# Altium schematic sheet reservoir_level_color.SchDoc
size A; SheetNumber: 1; SheetTotal: 1
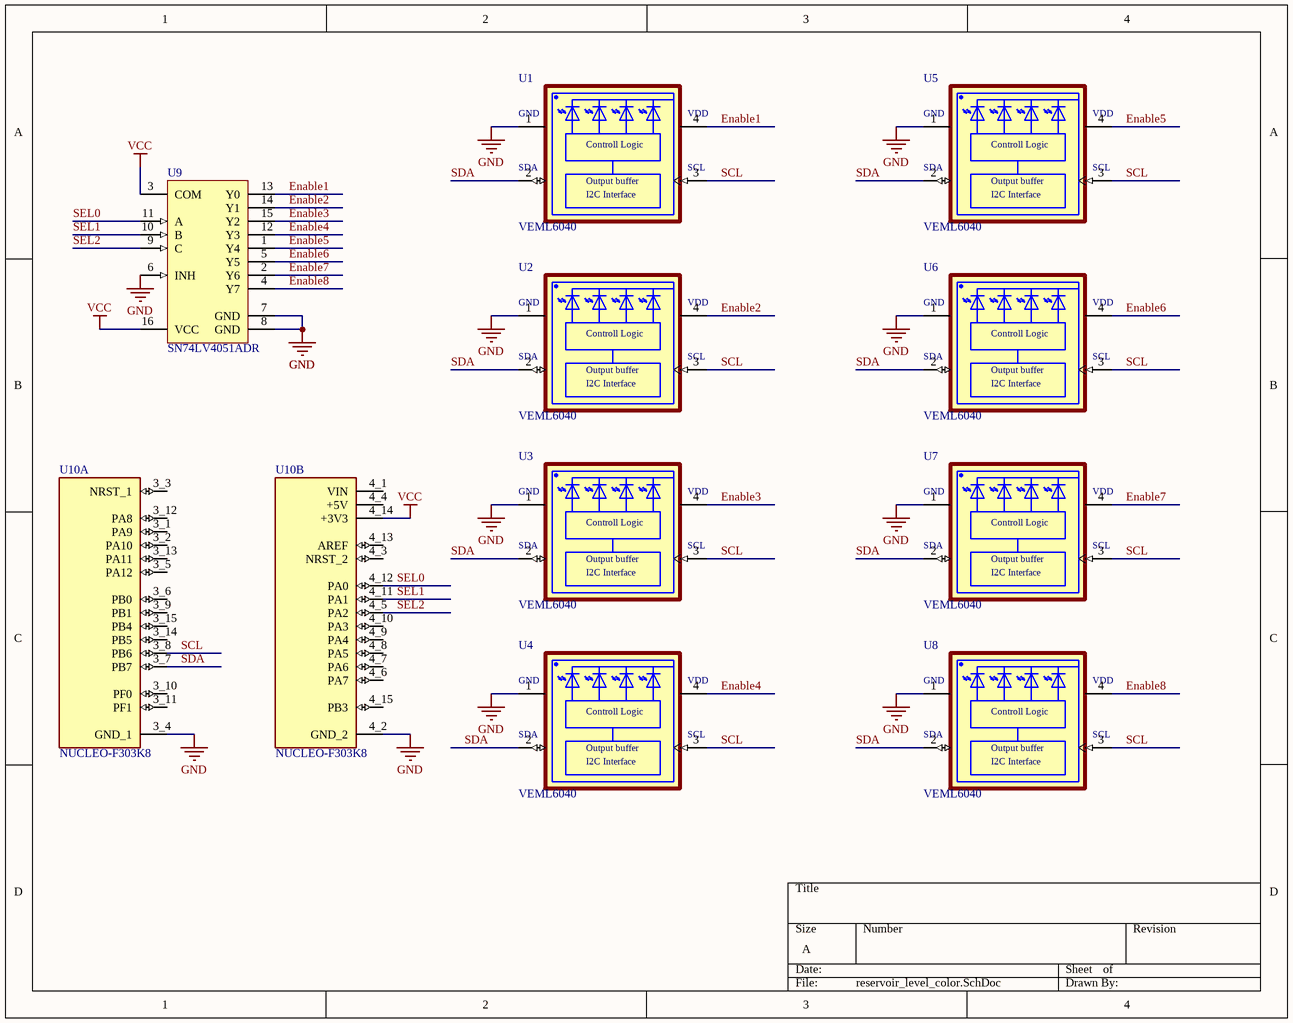
[diagram p0: reservoir_level_color.SchDoc]

## Parts
U1  VEML6040  [VISHAY_VEML6040_1.25X2X1]
U2  VEML6040  [VISHAY_VEML6040_1.25X2X1]
U3  VEML6040  [VISHAY_VEML6040_1.25X2X1]
U4  VEML6040  [VISHAY_VEML6040_1.25X2X1]
U5  VEML6040  [VISHAY_VEML6040_1.25X2X1]
U6  VEML6040  [VISHAY_VEML6040_1.25X2X1]
U7  VEML6040  [VISHAY_VEML6040_1.25X2X1]
U8  VEML6040  [VISHAY_VEML6040_1.25X2X1]
U9  SN74LV4051ADR  [D0016A_M]
U10  NUCLEO-F303K8  [MODULE_NUCLEO-F303K8]  (parts A,B of 2)

## Nets
GND: U1.1(GND) U2.1(GND) U3.1(GND) U4.1(GND) U5.1(GND) U6.1(GND) U7.1(GND) U8.1(GND) U9.6(INH) U9.7(GND) U9.8(GND) U10.3_4(GND_1) U10.4_2(GND_2)
VCC: U9.3(COM) U9.16(VCC) U10.4_14(+3V3)
Enable1: U1.4(VDD) U9.13(Y0)
Enable2: U2.4(VDD) U9.14(Y1)
Enable3: U3.4(VDD) U9.15(Y2)
Enable4: U4.4(VDD) U9.12(Y3)
Enable5: U5.4(VDD) U9.1(Y4)
Enable6: U6.4(VDD) U9.5(Y5)
Enable7: U7.4(VDD) U9.2(Y6)
Enable8: U8.4(VDD) U9.4(Y7)
SCL: U1.3(SCL) U2.3(SCL) U3.3(SCL) U4.3(SCL) U5.3(SCL) U6.3(SCL) U7.3(SCL) U8.3(SCL) U10.3_8(PB6)
SDA: U1.2(SDA) U2.2(SDA) U3.2(SDA) U4.2(SDA) U5.2(SDA) U6.2(SDA) U7.2(SDA) U8.2(SDA) U10.3_7(PB7)
SEL0: U9.11(A) U10.4_12(PA0)
SEL1: U9.10(B) U10.4_11(PA1)
SEL2: U9.9(C) U10.4_5(PA2)

Not connected (* = marked no-connect by the designer): U10 3_1(PA9) 3_2(PA10) 3_3(NRST_1) 3_5(PA12) 3_6(PB0) 3_9(PB1) 3_10(PF0) 3_11(PF1) 3_12(PA8) 3_13(PA11) 3_14(PB5) 3_15(PB4) 4_1(VIN) 4_3(NRST_2) 4_4(+5V) 4_6(PA7) 4_7(PA6) 4_8(PA5) 4_9(PA4) 4_10(PA3) 4_13(AREF) 4_15(PB3)

## Notes on the sheet
- (in symbol VEML6040) Controll Logic; Output buffer; I2C Interface

## Library data of the parts
U1-U8 = VEML6040: <b>VEML6040</b>  <p> RGBW Color Sensor with I2C Interface: <ul>   VEML6040 color sensor senses red, green, blue, and white light and incorporates photodiodes, amplifiers, and analog / digital circuits into a single chip using CMOS process. With the color sensor applied, the brightness, and color temperature of backlight can be adjusted base on ambient light source that makes panel looks more comfortable for end userâ€™s eyes. VEML6040â€™s adoption of FiltronTM technology achieves the closest ambient light spectral sensitivity to real human eye responses.  <ul> Device Model created 15.06.2016 by Johannes Kolb - Vishay Semiconductor GmbH; MF: {'manufacturer': u'Vishay'}; Price: None; Availability: Unavailable; Package: None; Value: *; MP: VEML6040
U9 = CMP-0802-00006-4: 8-Channel Analog Multiplexer/Demultiplexer, D0016A, LARGE T&R; Manufacturer: Texas Instruments; VCC(Min)(V): 2; Output Type: CMOS; VCC(Max)(V): 5.5; Bandwidth(Max)(MHz): 35; Rating: Catalog; Configuration: 1 X 1：8 MUX; Crosstalk: Yes; Ron(Max)(Ohms): 75; Ron(Typ)(Ohms): 22; PackageVersion: http://www.ti.com/lit/ml/mpds178g/mpds178g.pdf; Generic Part Number: SN74LV4051A; Operating Temperature Range(C): -40 to 85; Code_JEDEC: MS-012 variation AC; PackageReference: D0016A; DatasheetVersion: SCLS428H
U10 = NUCLEO-F303K8: MF: {'manufacturer': u'STMicroelectronics'}; Package: None; MP: NUCLEO-F303K8; Price: None; Value: *; Availability: Unavailable